# Altium schematic sheet W040 24011506-06PBS SCH.SchDoc
size D; SheetNumber: 0; SheetTotal: 0
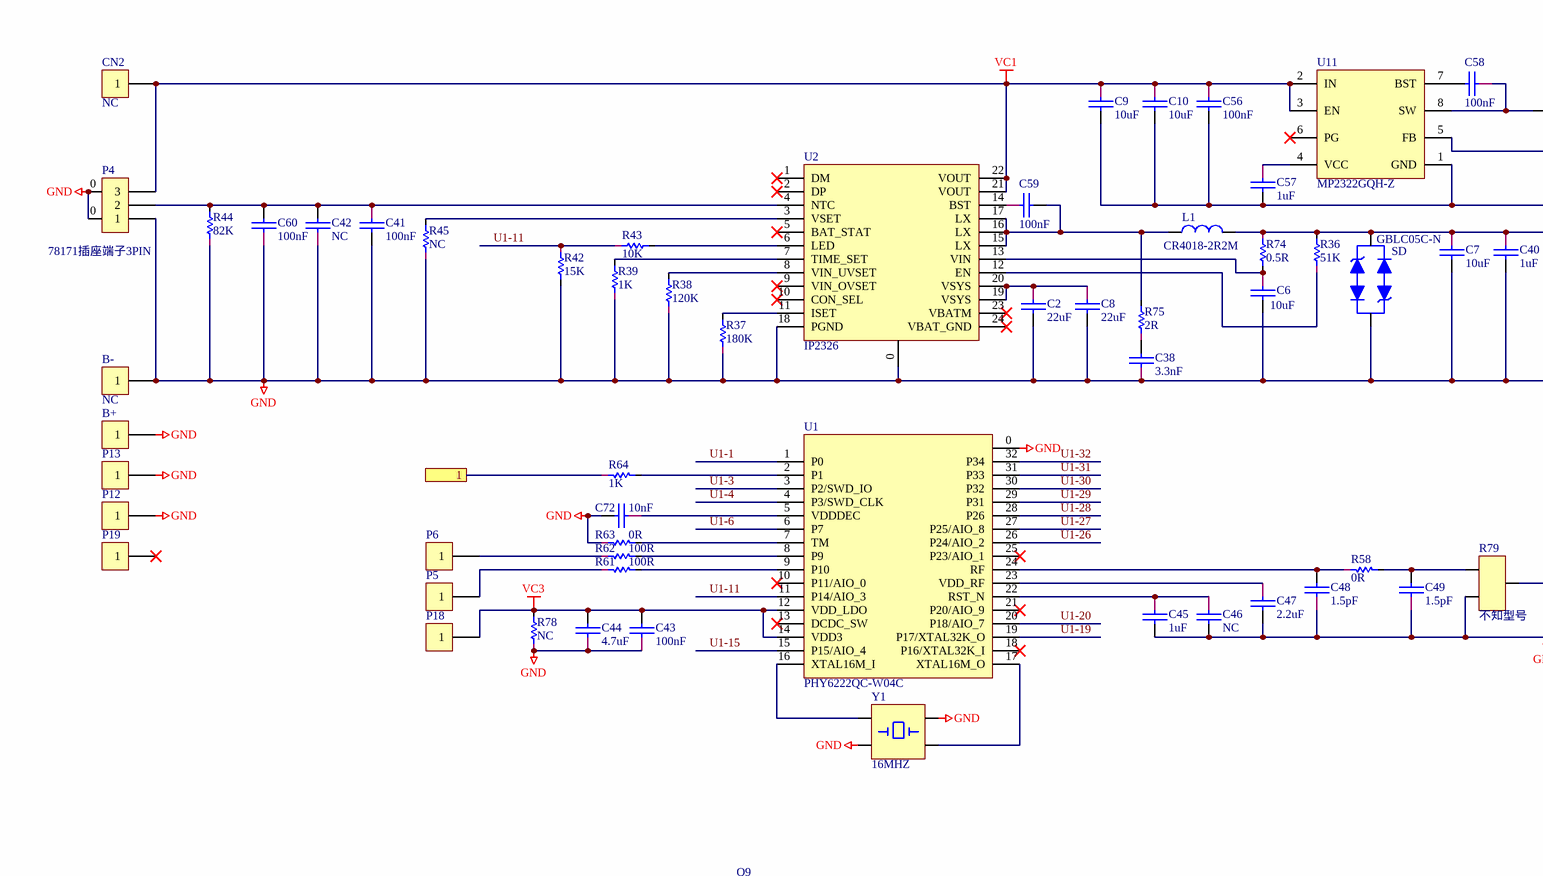
[diagram p0: W040 24011506-06PBS SCH.SchDoc, top left]
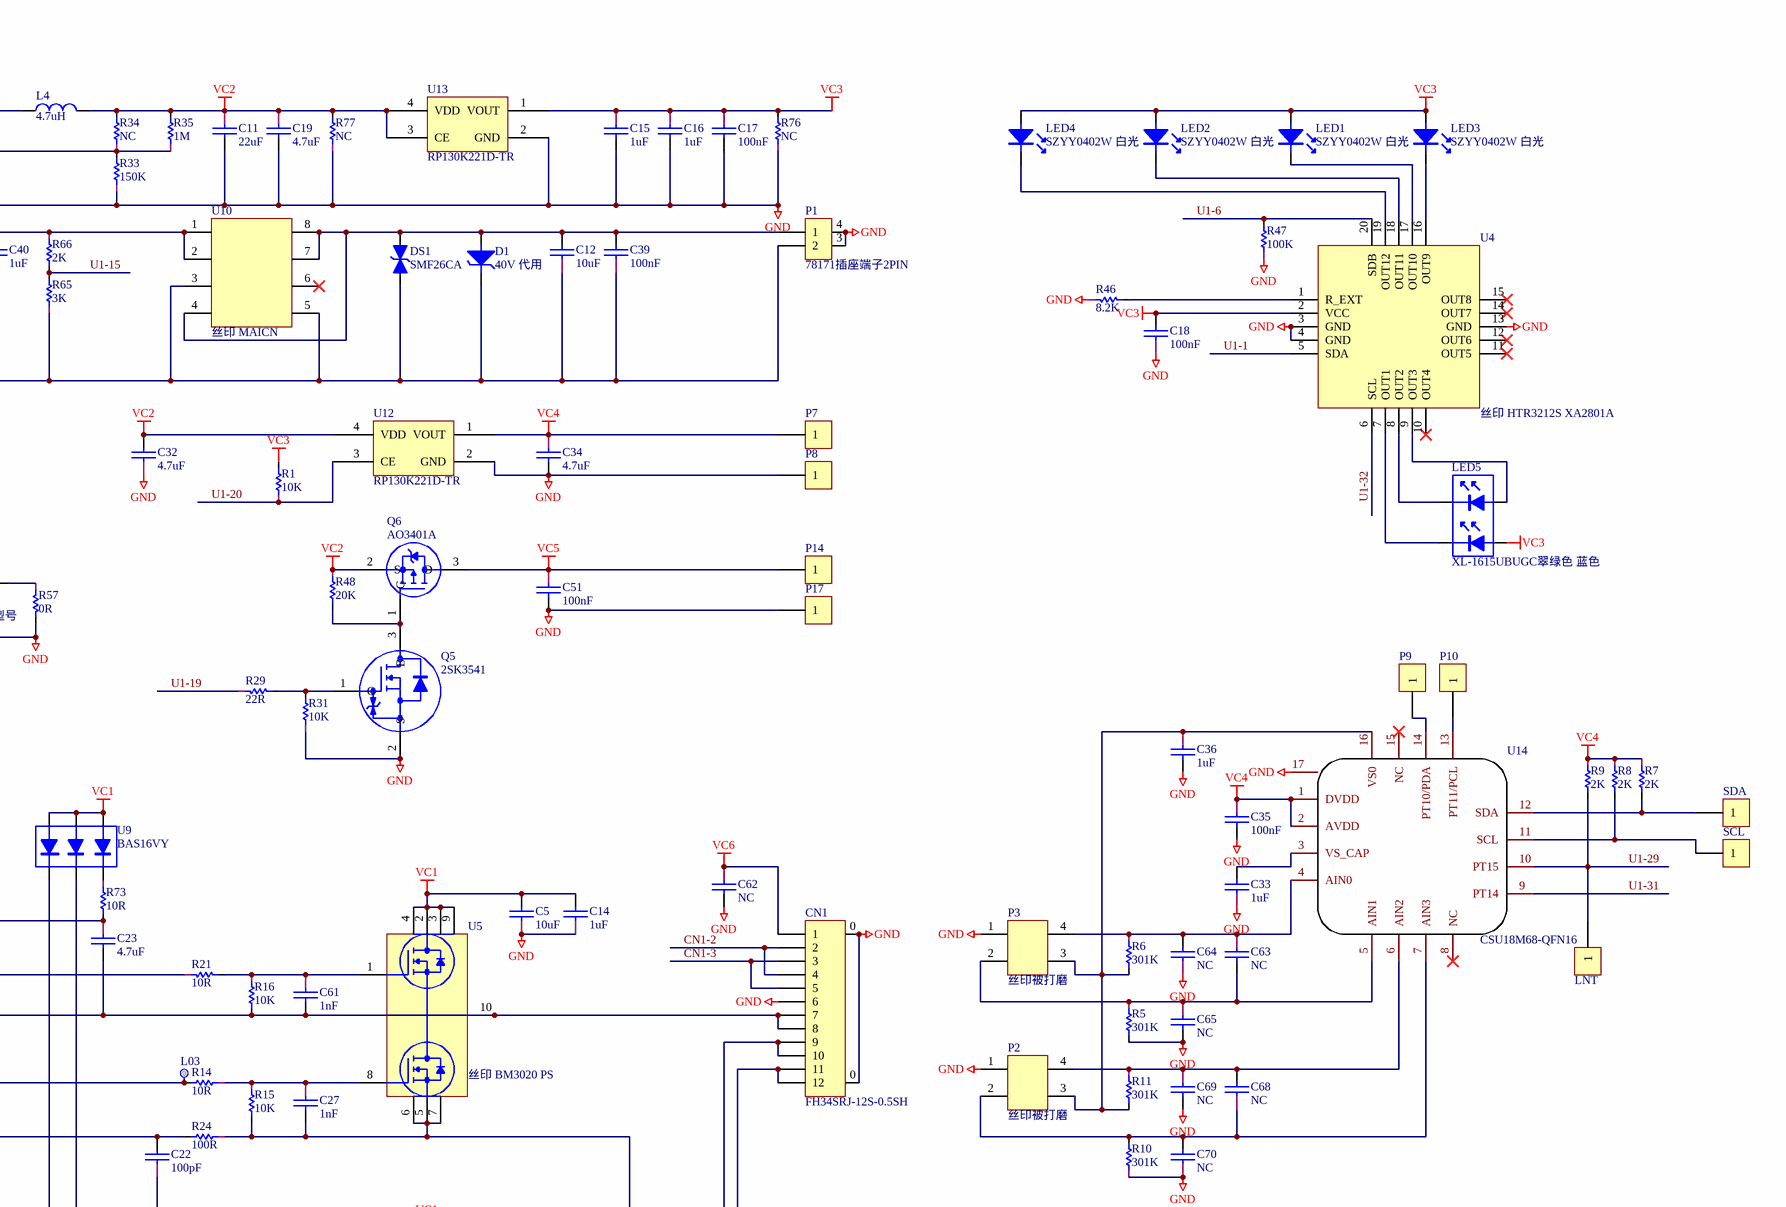
[diagram p1: W040 24011506-06PBS SCH.SchDoc, top right]
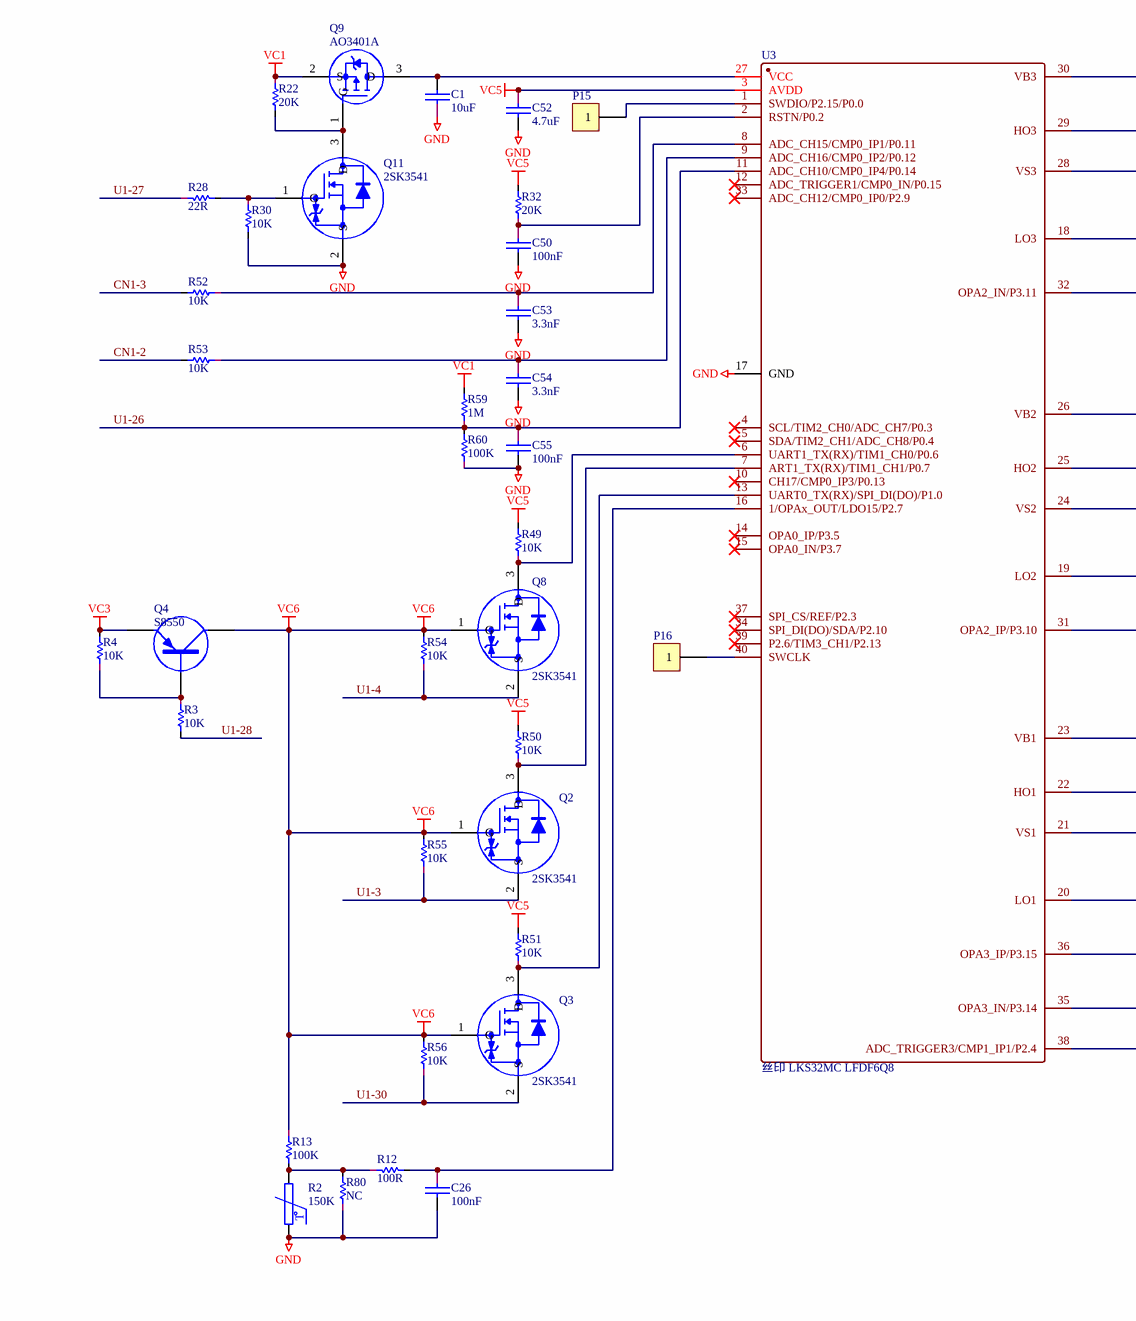
[diagram p2: W040 24011506-06PBS SCH.SchDoc, bottom left]
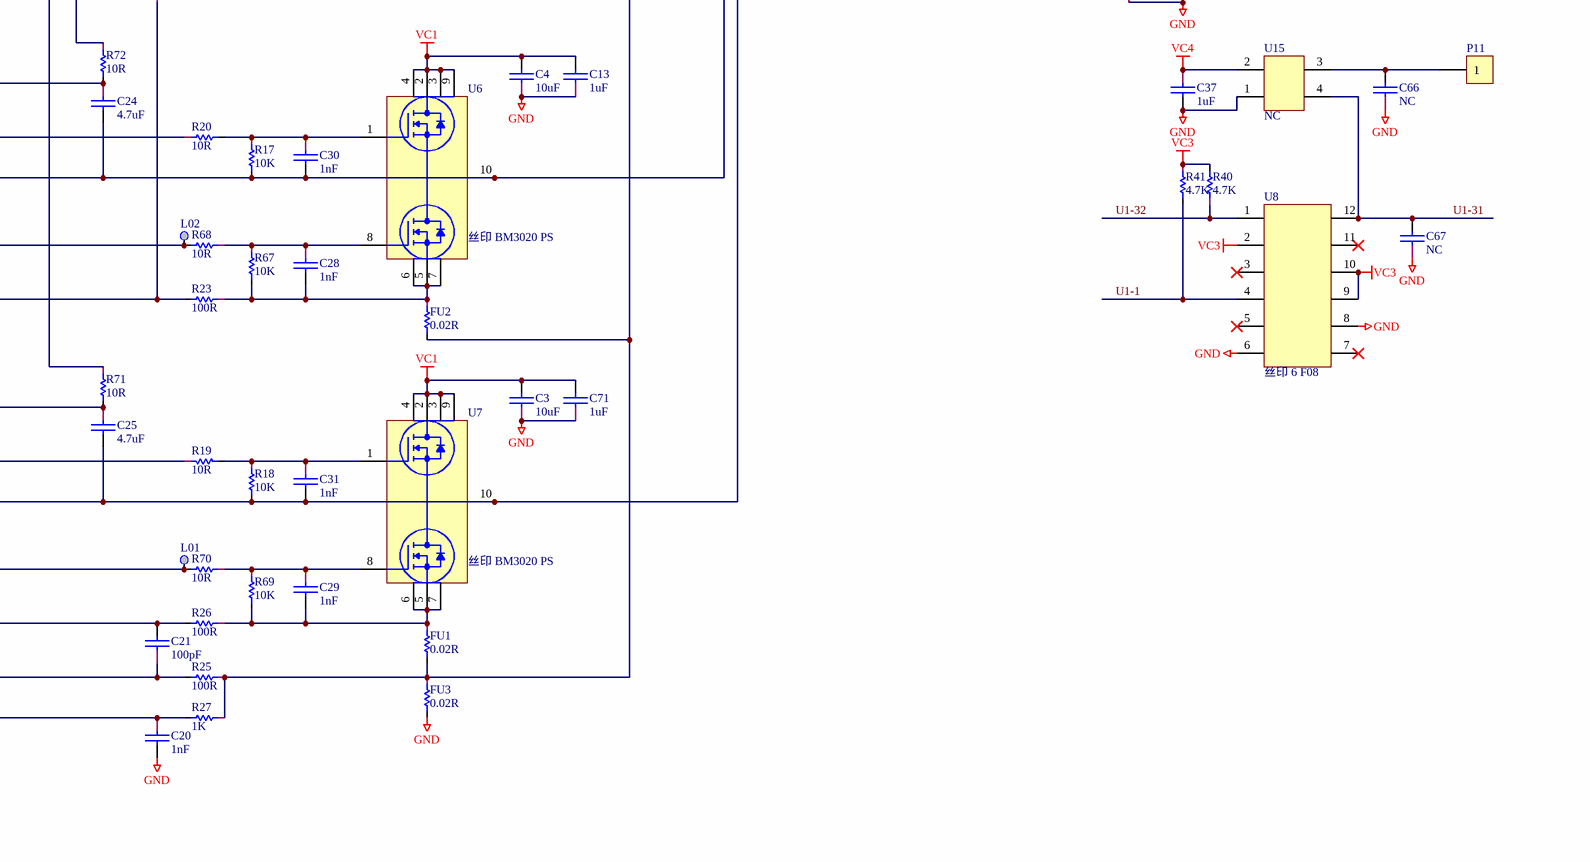
[diagram p3: W040 24011506-06PBS SCH.SchDoc, bottom right]

## Parts
B+  (no value)  [SMD-1]
B-  NC  [SMD-1]
C1  10uF  [C0603]
C2  22uF  [C0603]
C3  10uF  [C0603]
C4  10uF  [C0603]
C5  10uF  [C0603]
C6  10uF  [C0603]
C7  10uF  [C0603]
C8  22uF  [C0603]
C9  10uF  [C0603]
C10  10uF  [C0603]
C11  22uF  [C0603]
C12  10uF  [C0603]
C13  1uF  [C0402]
C14  1uF  [C0402]
C15  1uF  [C0402]
C16  1uF  [C0402]
C17  100nF  [C0402]
C18  100nF  [C0402]
C19  4.7uF  [C0402]
C20  1nF  [C0402]
C21  100pF  [C0402]
C22  100pF  [C0402]
C23  4.7uF  [C0402]
C24  4.7uF  [C0402]
C25  4.7uF  [C0402]
C26  100nF  [C0402]
C27  1nF  [C0402]
C28  1nF  [C0402]
C29  1nF  [C0402]
C30  1nF  [C0402]
C31  1nF  [C0402]
C32  4.7uF  [C0402]
C33  1uF  [C0402]
C34  4.7uF  [C0402]
C35  100nF  [C0402]
C36  1uF  [C0402]
C37  1uF  [C0402]
C38  3.3nF  [C0402]
C39  100nF  [C0402-1]
C40  1uF  [C0402]
C41  100nF  [C0402]
C42  NC  [C0402]
C43  100nF  [C0402]
C44  4.7uF  [C0402]
C45  1uF  [C0402]
C46  NC  [C0402]
C47  2.2uF  [C0402]
C48  1.5pF  [C0402]
C49  1.5pF  [C0402]
C50  100nF  [C0402]
C51  100nF  [C0402]
C52  4.7uF  [C0402]
C53  3.3nF  [C0402]
C54  3.3nF  [C0402]
C55  100nF  [C0402]
C56  100nF  [C0402]
C57  1uF  [C0402]
C58  100nF  [C0402]
C59  100nF  [C0402]
C60  100nF  [C0402]
C61  1nF  [C0402]
C62  NC  [C0402]
C63  NC  [C0402]
C64  NC  [C0402]
C65  NC  [C0402]
C66  NC  [C0402]
C67  NC  [C0402]
C68  NC  [C0402]
C69  NC  [C0402]
C70  NC  [C0402]
C71  1uF  [C0402]
C72  10nF  [C0402]
CN1  FH34SRJ-12S-0.5SH  [SMD-12]
CN2  NC  [SMD-1]
D1  40V 代用  [SOD-323]
DS1  SMF26CA  [SMD-128]
FU1  0.02R  [FU0805]
FU2  0.02R  [FU0805]
FU3  0.02R  [FU0805]
L1  CR4018-2R2M  [L1206]
L01  (no value)  [DIP-1]
L02  (no value)  [DIP-1]
L03  (no value)  [DIP-1]
L4  4.7uH  [L0805]
LED1  SZYY0402W 白光  [LED0402]
LED2  SZYY0402W 白光  [LED0402]
LED3  SZYY0402W 白光  [LED0402]
LED4  SZYY0402W 白光  [LED0402]
LED5  XL-1615UBUGC翠绿色 蓝色  [LED0402-1]
LNT  (no value)  [SMD-1]
P1  78171插座端子2PIN  [SMD-2]
P2  丝印被打磨  [SMD-4]
P3  丝印被打磨  [SMD-4]
P4  78171插座端子3PIN  [SMD-5]
P5  (no value)  [SMD-1]
P6  (no value)  [SMD-1]
P7  (no value)  [SMD-1]
P8  (no value)  [SMD-1]
P9  (no value)  [SMD-1]
P10  (no value)  [SMD-1]
P11  (no value)  [SMD-1]
P12  (no value)  [SMD-1]
P13  (no value)  [SMD-1]
P14  (no value)  [SMD-1]
P15  (no value)  [SMD-1]
P16  (no value)  [SMD-1]
P17  (no value)  [SMD-1]
P18  (no value)  [SMD-1]
P19  (no value)  [SMD-10]
Q2  2SK3541  [SOT23-3-1]
Q3  2SK3541  [SOT23-3-1]
Q4  S8550  [SOT23-3]
Q5  2SK3541  [SOT23-3-1]
Q6  AO3401A  [SOT23-3]
Q8  2SK3541  [SOT23-3-1]
Q9  AO3401A  [SOT23-3]
Q11  2SK3541  [SOT23-3-1]
R1  10K  [R0402]
R2  150K  [R0402]
R3  10K  [R0402]
R4  10K  [R0402]
R5  301K  [R0402]
R6  301K  [R0402]
R7  2K  [R0402]
R8  2K  [R0402]
R9  2K  [R0402]
R10  301K  [R0402]
R11  301K  [R0402]
R12  100R  [R0402]
R13  100K  [R0402]
R14  10R  [R0402]
R15  10K  [R0402]
R16  10K  [R0402]
R17  10K  [R0402]
R18  10K  [R0402]
R19  10R  [R0402]
R20  10R  [R0402]
R21  10R  [R0402]
R22  20K  [R0402]
R23  100R  [R0402]
R24  100R  [R0402]
R25  100R  [R0402]
R26  100R  [R0402]
R27  1K  [R0402]
R28  22R  [R0402]
R29  22R  [R0402]
R30  10K  [R0402]
R31  10K  [R0402]
R32  20K  [R0402]
R33  150K  [R0402]
R34  NC  [R0402]
R35  1M  [R0402]
R36  51K  [R0402]
R37  180K  [R0402]
R38  120K  [R0402]
R39  1K  [R0402]
R40  4.7K  [R0402]
R41  4.7K  [R0402]
R42  15K  [R0402]
R43  10K  [R0402]
R44  82K  [R0402]
R45  NC  [R0402]
R46  8.2K  [R0402]
R47  100K  [R0402]
R48  20K  [R0402]
R49  10K  [R0402]
R50  10K  [R0402]
R51  10K  [R0402]
R52  10K  [R0402]
R53  10K  [R0402]
R54  10K  [R0402]
R55  10K  [R0402]
R56  10K  [R0402]
R57  0R  [R0402]
R58  0R  [R0402]
R59  1M  [R0402]
R60  100K  [R0402]
R61  100R  [R0402]
R62  100R  [R0402]
R63  0R  [R0402]
R64  1K  [R0402]
R65  3K  [R0402]
R66  2K  [R0402]
R67  10K  [R0402]
R68  10R  [R0402]
R69  10K  [R0402]
R70  10R  [R0402]
R71  10R  [R0603]
R72  10R  [R0603]
R73  10R  [R0603]
R74  0.5R  [R0603]
R75  2R  [R0603]
R76  NC  [R0201]
R77  NC  [R0201]
R78  NC  [R0201]
R79  不知型号  [R0603-1]
R80  NC  [R0805]
SCL  (no value)  [SMD-1]
SD  GBLC05C-N  [SMA-502]
SDA  (no value)  [SMD-1]
U1  PHY6222QC-W04C  [OFN-32]
U2  IP2326  [OFN-24]
U3  丝印 LKS32MC LFDF6Q8  [QFP-40]
U4  丝印 HTR3212S XA2801A  [OFN-20]
U5  丝印 BM3020 PS  [SOP-8]
U6  丝印 BM3020 PS  [SOP-8]
U7  丝印 BM3020 PS  [SOP-8]
U8  丝印 6 F08  [SOP-12]
U9  BAS16VY  [SOP-6]
U10  丝印 MAICN  [SOP-8 - 1]
U11  MP2322GQH-Z  [SOP-8-2]
U12  RP130K221D-TR  [SOP4]
U13  RP130K221D-TR  [SOP4]
U14  CSU18M68-QFN16  [OFN-16]
U15  NC  [SOP4]
Y1  16MHZ  [OSC5032-4P]

## Ports
1

## Nets
GND: B+.1 B-.1 C1.2 C2.1 C3.2 C4.2 C5.2 C6.1 C7.1 C8.1 C9.1 C10.1 C11.1 C12.2 C13.2 C14.2 C15.1 C16.1 C17.1 C18.2 C19.1 C20.1 C26.1 C32.2 C33.2 C34.1 C35.1 C36.1 C37.1 C38.2 C39.2 C40.1 C41.1 C42.2 C43.2 C44.2 C45.1 C46.1 C47.1 C48.2 C49.2 C50.1 C51.1 C52.1 C53.1 C54.1 C55.1 C56.1 C57.1 C60.2 C62.1 C64.2 C65.1 C66.2 C67.2 C69.1 C70.2 C71.2 C72.1 CN1.0 CN1.6 D1.2 DS1.2(K) FU3.1 P1.2 P1.3 P1.4 P2.1 P3.1 P4.0 P4.1 P8.1 P12.1 P13.1 P17.1 Q5.2(S) Q11.2(S) R2.1 R5.1 R10.2 R30.1 R31.2 R33.2 R37.2 R38.2 R39.2 R42.1 R44.2 R45.2 R46.2 R47.2 R57.1 R60.2 R63.2 R65.2 R76.2 R77.2 R78.2 R79.3 R80.2 SD.1 U1.0 U2.0 U2.18(PGND) U3.17(GND) U4.3(GND) U4.4(GND) U4.13(GND) U8.6 U8.8 U10.3 U10.5 U11.1(GND) U12.2(GND) U13.2(GND) U14.17 U15.1 Y1.1 Y1.3
VC1: C3.1 C4.1 C5.1 C9.2 C10.2 C13.1 C14.1 C56.2 C71.1 CN2.1 P4.3 Q9.2(S) R22.2 R59.1 U2.21(VOUT) U2.22(VOUT) U5.2(D1) U5.3(D1) U5.4(D1) U5.9(D1) U6.2(D1) U6.3(D1) U6.4(D1) U6.9(D1) U7.2(D1) U7.3(D1) U7.4(D1) U7.9(D1) U9.1 U9.2 U9.3 U11.2(IN) U11.3(EN)
VC2: C11.2 C19.2 C32.1 L4.2 Q6.2(S) R34.1 R35.1 R48.2 R77.1 U12.4(VDD) U13.3(CE) U13.4(VDD)
VC3: C15.2 C16.2 C17.2 C18.1 C43.1 C44.1 LED1.1 LED2.1 LED3.1 LED4.1 LED5.3 P18.1 Q4.2(E) R1.1 R4.1 R40.1 R41.2 R76.1 R78.1 U1.12(VDD_LDO) U1.14(VDD3) U4.2(VCC) U8.2 U8.9 U8.10 U13.1(VOUT)
VC4: C34.2 C35.2 C37.2 P7.1 R7.2 R8.2 R9.2 U12.1(VOUT) U14.1(DVDD) U14.2(AVDD) U15.2
VC5: C51.2 C52.2 P14.1 Q6.3(D) R32.1 R49.1 R50.1 R51.1 U3.3(AVDD)
VC6: C62.2 CN1.1 Q2.1(G) Q3.1(G) Q4.3(C) Q8.1(G) R13.2 R54.1 R55.1 R56.1
1: R64.2 ; port 1
CN1-2: CN1.2 CN1.4 R53.1
CN1-3: CN1.3 CN1.5 R52.1
U1-1: R41.1 U1.1(P0) U4.5(SDA) U8.4
U1-3: Q2.2(S) R55.2 U1.3(P2/SWD_IO)
U1-4: Q8.2(S) R54.2 U1.4(P3/SWD_CLK)
U1-6: R47.1 U1.6(P7) U4.20(SDB)
U1-11: R42.2 R43.2 U1.11(P14/AIO_3)
U1-15: R65.1 R66.1 U1.15(P15/AIO_4)
U1-19: R29.2 U1.19(P17/XTAL32K_O)
U1-20: R1.2 U1.20(P18/AIO_7) U12.3(CE)
U1-26: C55.2 R59.2 R60.1 U1.26(P24/AIO_2) U3.11(ADC_CH10/CMP0_IP4/P0.14)
U1-27: R28.2 U1.27(P25/AIO_8)
U1-28: R3.1 U1.28(P26)
U1-29: LNT.1 R9.1 U1.29(P31) U14.10(PT15)
U1-30: Q3.2(S) R56.2 U1.30(P32)
U1-31: C67.1 U1.31(P33) U8.12 U14.9(PT14) U15.4
U1-32: R40.2 U1.32(P34) U4.6(SCL) U8.1
NetC1_1: C1.1 Q9.3(D) U3.27(VCC)
NetC2_2: C2.2 C8.2 U2.19(VSYS) U2.20(VSYS)
NetC6_2: C6.2 R74.1 U2.13(VIN)
NetC7_2: C7.2 C40.2 L1.1 R36.1 R66.2 R74.2 SD.2 U10.1 U10.2
NetC12_1: C12.1 C39.1 D1.1 DS1.1(A) P1.1 U10.4 U10.7 U10.8
NetC20_2: C20.2 R27.1 U3.38(ADC_TRIGGER3/CMP1_IP1/P2.4)
NetC21_1: C21.1 R26.1 U3.36(OPA3_IP/P3.15)
NetC21_2: C21.2 R25.1 U3.35(OPA3_IN/P3.14)
NetC22_1: C22.1 R24.1 U3.32(OPA2_IN/P3.11)
NetC22_2: C22.2 R23.1 U3.31(OPA2_IP/P3.10)
NetC23_1: C23.1 C61.1 CN1.7 CN1.8 R16.1 U3.28(VS3) U5.10(S1/D2)
NetC23_2: C23.2 R73.1 U3.30(VB3)
NetC24_1: C24.1 C30.1 CN1.9 CN1.10 R17.1 U3.24(VS2) U6.10(S1/D2)
NetC24_2: C24.2 R72.1 U3.26(VB2)
NetC25_1: C25.1 C31.1 CN1.11 CN1.12 R18.1 U3.21(VS1) U7.10(S1/D2)
NetC25_2: C25.2 R71.1 U3.23(VB1)
NetC26_2: C26.2 R12.1 U3.16(1/OPAx_OUT/LDO15/P2.7)
NetC27_1: C27.1 FU1.1 FU2.1 FU3.2 R15.1 R24.2 R25.2 R27.2 U5.5(S2) U5.6(S2) U5.7(S2)
NetC27_2: C27.2 R14.2 R15.2 U5.8(G2)
NetC28_1: C28.1 FU2.2 R23.2 R67.1 U6.5(S2) U6.6(S2) U6.7(S2)
NetC28_2: C28.2 R67.2 R68.2 U6.8(G2)
NetC29_1: C29.1 FU1.2 R26.2 R69.1 U7.5(S2) U7.6(S2) U7.7(S2)
NetC29_2: C29.2 R69.2 R70.2 U7.8(G2)
NetC30_2: C30.2 R17.2 R20.1 U6.1(G1)
NetC31_2: C31.2 R18.2 R19.1 U7.1(G1)
NetC33_1: C33.1 U14.3(VS_CAP)
NetC36_2: C36.2 P2.3 P3.3 R6.1 R11.1 U14.16(VS0)
NetC38_1: C38.1 R75.2
NetC41_2: C41.2 C42.1 C60.1 P4.2 R44.1 U2.4(NTC)
NetC45_2: C45.2 C46.2 U1.22(RST_N)
NetC47_2: C47.2 U1.23(VDD_RF)
NetC48_1: C48.1 R58.2 U1.24(RF)
NetC49_1: C49.1 R58.1 R79.2
NetC50_2: C50.2 R32.2 U3.2(RSTN/P0.2)
NetC53_2: C53.2 R52.2 U3.8(ADC_CH15/CMP0_IP1/P0.11)
NetC54_2: C54.2 R53.2 U3.9(ADC_CH16/CMP0_IP2/P0.12)
NetC57_2: C57.2 U11.4(VCC)
NetC58_1: C58.1 U11.7(BST)
NetC58_2: C58.2 L4.1 U11.8(SW)
NetC59_1: C59.1 L1.2 R75.1 U2.15(LX) U2.16(LX) U2.17(LX)
NetC59_2: C59.2 U2.14(BST)
NetC61_2: C61.2 R16.2 R21.1 U5.1(G1)
NetC63_1: C63.1 C65.2 P3.2 R5.2 U14.5(AIN1)
NetC63_2: C63.2 C64.1 P3.4 R6.2 U14.4(AIN0)
NetC66_1: C66.1 P11.1 U15.3
NetC68_1: C68.1 C69.2 P2.4 R11.2 U14.6(AIN2)
NetC68_2: C68.2 C70.1 P2.2 R10.1 U14.7(AIN3)
NetC72_2: C72.2 U1.5(VDDDEC)
NetL01_1: L01.1 R70.1 U3.20(LO1)
NetL02_1: L02.1 R68.1 U3.19(LO2)
NetL03_1: L03.1 R14.1 U3.18(LO3)
NetLED1_2: LED1.2 U4.17(OUT10)
NetLED2_2: LED2.2 U4.18(OUT11)
NetLED3_2: LED3.2 U4.16(OUT9)
NetLED4_2: LED4.2 U4.19(OUT12)
NetLED5_1: LED5.1 U4.8(OUT2)
NetLED5_2: LED5.2 U4.7(OUT1)
NetLED5_4: LED5.4 U4.9(OUT3)
NetP5_1: P5.1 R61.2
NetP6_1: P6.1 R62.2
NetP9_1: P9.1 U14.14(PT10/PDA)
NetP10_1: P10.1 U14.13(PT11/PCL)
NetP15_1: P15.1 U3.1(SWDIO/P2.15/P0.0)
NetP16_1: P16.1 U3.40(SWCLK)
NetQ2_3: Q2.3(D) R50.2 U3.7(ART1_TX(RX)/TIM1_CH1/P0.7)
NetQ3_3: Q3.3(D) R51.2 U3.13(UART0_TX(RX)/SPI_DI(DO)/P1.0)
NetQ4_1: Q4.1(B) R3.2 R4.2
NetQ5_1: Q5.1(G) R29.1 R31.1
NetQ5_3: Q5.3(D) Q6.1(G) R48.1
NetQ8_3: Q8.3(D) R49.2 U3.6(UART1_TX(RX)/TIM1_CH0/P0.6)
NetQ9_1: Q9.1(G) Q11.3(D) R22.1
NetQ11_1: Q11.1(G) R28.1 R30.2
NetR2_2: R2.2 R12.2 R13.1 R80.1
NetR7_1: R7.1 SDA.1 U14.12(SDA)
NetR8_1: R8.1 SCL.1 U14.11(SCL)
NetR19_2: R19.2 U3.22(HO1)
NetR20_2: R20.2 U3.25(HO2)
NetR21_2: R21.2 U3.29(HO3)
NetR33_1: R33.1 R34.2 R35.2 U11.5(FB)
NetR36_2: R36.2 U2.12(EN)
NetR37_1: R37.1 U2.11(ISET)
NetR38_1: R38.1 U2.8(VIN_UVSET)
NetR39_1: R39.1 U2.7(TIME_SET)
NetR43_1: R43.1 U2.6(LED)
NetR45_1: R45.1 U2.3(VSET)
NetR46_1: R46.1 U4.1(R_EXT)
NetR57_2: R57.2 R79.1
NetR61_1: R61.1 U1.9(P10)
NetR62_1: R62.1 U1.8(P9)
NetR63_1: R63.1 U1.7(TM)
NetR64_1: R64.1 U1.2(P1)
NetR71_2: R71.2 U9.6
NetR72_2: R72.2 U9.5
NetR73_2: R73.2 U9.4
NetU1_16: U1.16(XTAL16M_I) Y1.4
NetU1_17: U1.17(XTAL16M_O) Y1.2

Not connected (* = marked no-connect by the designer): P19 1*; U1 10(P11/AIO_0)* 13(DCDC_SW)* 18(P16/XTAL32K_I)* 21(P20/AIO_9)* 25(P23/AIO_1)*; U2 1(DM)* 2(DP)* 5(BAT_STAT)* 9(VIN_OVSET)* 10(CON_SEL)* 23(VBATM)* 24(VBAT_GND)*; U3 4(SCL/TIM2_CH0/ADC_CH7/P0.3)* 5(SDA/TIM2_CH1/ADC_CH8/P0.4)* 10(CH17/CMP0_IP3/P0.13)* 12(ADC_TRIGGER1/CMP0_IN/P0.15)* 14(OPA0_IP/P3.5)* 15(OPA0_IN/P3.7)* 33(ADC_CH12/CMP0_IP0/P2.9)* 34(SPI_DI(DO)/SDA/P2.10)* 37(SPI_CS/REF/P2.3)* 39(P2.6/TIM3_CH1/P2.13)*; U4 10(OUT4)* 11(OUT5)* 12(OUT6)* 14(OUT7)* 15(OUT8)*; U8 3* 5* 7* 11*; U10 6*; U11 6(PG)*; U14 8(NC)* 15(NC)*

## Notes on the sheet
- (in symbol RES2-R) T

## Library data of the parts
B+ B- CN2 LNT P5-P19 SCL SDA = CON1: Connector
C1-C72 = CAP: Capacitor
CN1 = CON12: Connector
D1 = DIODE VARACTOR: Varactor Diode
DS1 = DIODE-3
FU1-FU3 R1 R3-R78 R80 = RAS
L1 L4 = INDUCTOR
L01 L02 L03 = T
LED1-LED4 = LED
LED5 = LED-1
P1 = CON2: Connector
P2 P3 U15 = 4
P4 = CON3.: Connector
Q2 Q3 Q5 Q8 Q11 = 2SK2462
Q4 = PNP-BEC: PNP Transistor
Q6 Q9 = P-GSD
R2 = RES2-R
R79 = 3
SD = BV05C
U3 = LKS32MC084DF6Q8
U4 = HTR3212S
U5-U7 = CJBM3020
U8 = 12
U9 = DIODE6
U10 = 8
U12 U13 = RP114K121D5
U14 = CSU18M68
Y1 = CRYSTAL4-1